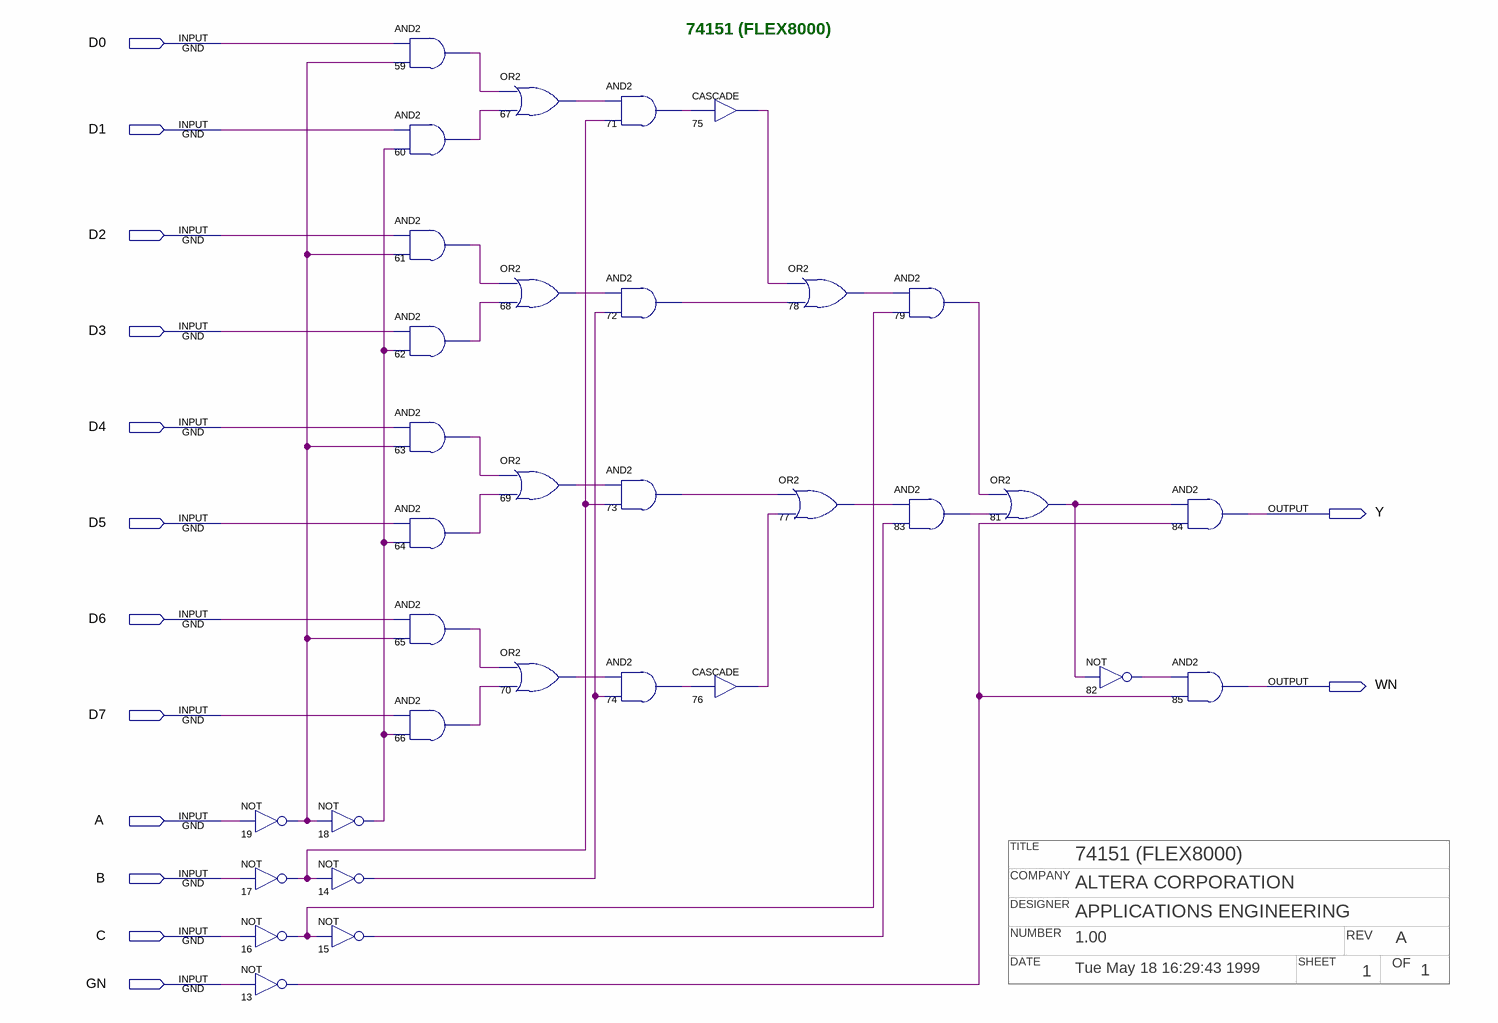
[diagram p0: schematic sheet]
// Quartus schematic f74151b.bdf as structural Verilog: 33 symbols, 14 pins
// Title block: TITLE: 74151 (FLEX8000); COMPANY: ALTERA CORPORATION; DESIGNER: APPLICATIONS ENGINEERING; NUMBER: 1.00; REV: A; DATE: Tue May 18 16:29:43 1999; SHEET: 1; OF: 1
module f74151b (
  input  D0,
  input  D1,
  input  D2,
  input  D3,
  input  D4,
  input  D5,
  input  D6,
  input  D7,
  input  A,
  input  B,
  input  C,
  input  GN,
  output Y,
  output WN
);

  wire n13_out, n14_out, n15_out, n16_out, n17_out, n18_out, n19_out, n59_out, n60_out, n61_out, n62_out,
       n63_out, n64_out, n65_out, n66_out, n67_out, n68_out, n69_out, n70_out, n71_out, n72_out, n73_out,
       n74_out, n75_out, n76_out, n77_out, n78_out, n79_out, n81_out, n82_out, n83_out;

  not u_19 (n19_out, A);
  not u_17 (n17_out, B);
  not u_16 (n16_out, C);
  not u_13 (n13_out, GN);
  not u_18 (n18_out, n19_out);
  not u_14 (n14_out, n17_out);
  not u_15 (n15_out, n16_out);
  and u_59 (n59_out, D0, n19_out);
  and u_60 (n60_out, D1, n18_out);
  and u_61 (n61_out, D2, n19_out);
  and u_62 (n62_out, D3, n18_out);
  and u_63 (n63_out, D4, n19_out);
  and u_64 (n64_out, D5, n18_out);
  and u_65 (n65_out, D6, n19_out);
  and u_66 (n66_out, D7, n18_out);
  or u_67 (n67_out, n59_out, n60_out);
  or u_68 (n68_out, n61_out, n62_out);
  or u_69 (n69_out, n63_out, n64_out);
  or u_70 (n70_out, n65_out, n66_out);
  and u_71 (n71_out, n67_out, n17_out);
  and u_72 (n72_out, n68_out, n14_out);
  and u_73 (n73_out, n69_out, n17_out);
  and u_74 (n74_out, n70_out, n14_out);
  CASCADE u_75 (.IN(n71_out), .OUT(n75_out));
  CASCADE u_76 (.IN(n74_out), .OUT(n76_out));
  or u_77 (n77_out, n73_out, n76_out);
  or u_78 (n78_out, n75_out, n72_out);
  and u_79 (n79_out, n78_out, n16_out);
  and u_83 (n83_out, n77_out, n15_out);
  or u_81 (n81_out, n79_out, n83_out);
  not u_82 (n82_out, n81_out);
  and u_84 (Y, n81_out, n13_out);
  and u_85 (WN, n82_out, n13_out);

  // Notes on the sheet:
  //   74151 (FLEX8000)
endmodule
